# Altium schematic sheet MotherBoard_PowerSupply.SchDoc
size A4; DocumentNumber: 6; SheetNumber: 6; SheetTotal: 9
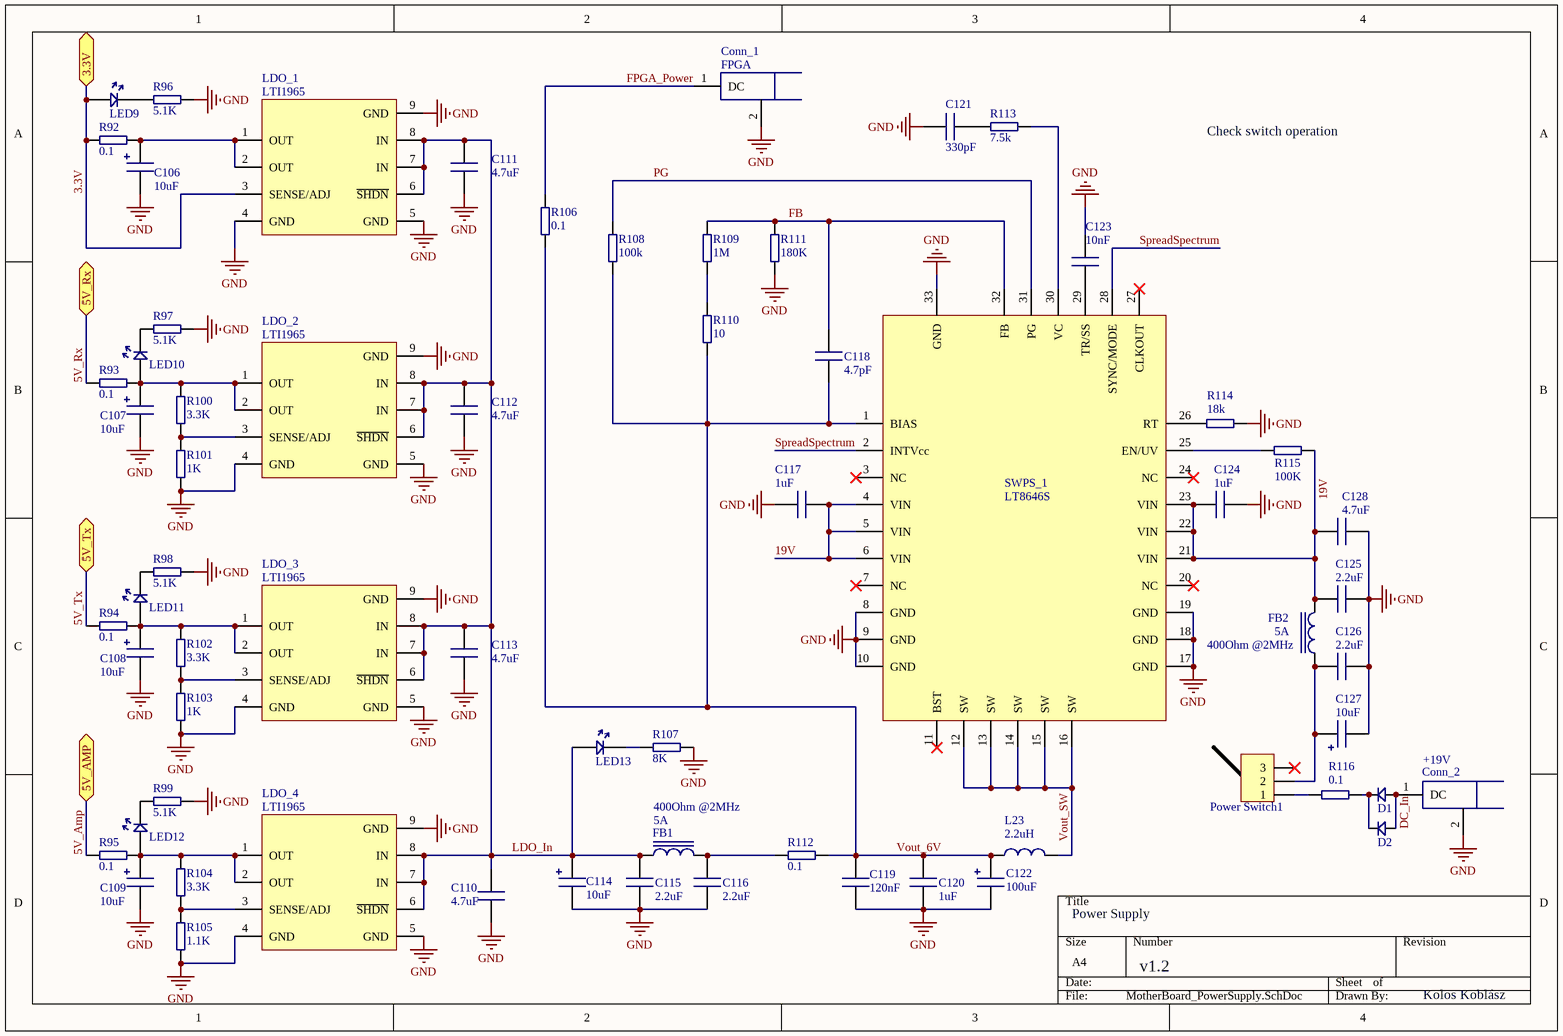
[diagram p0: MotherBoard_PowerSupply.SchDoc]

## Parts
C106  value 10uF  [ELKO_CAP]  (hidden comment: Cap2)
C107  value 10uF  [ELKO_CAP]  (hidden comment: Cap2)
C108  value 10uF  [ELKO_CAP]  (hidden comment: Cap2)
C109  value 10uF  [ELKO_CAP]  (hidden comment: Cap2)
C110  value 4.7uF  [0805 SMD Passive]  (hidden comment: Cap1)
C111  value 4.7uF  [0805 SMD Passive]  (hidden comment: Cap1)
C112  value 4.7uF  [0805 SMD Passive]  (hidden comment: Cap1)
C113  value 4.7uF  [0805 SMD Passive]  (hidden comment: Cap1)
C114  value 10uF  [ELKO_CAP]  (hidden comment: Cap2)
C115  value 2.2uF  [0805 SMD Passive]  (hidden comment: Cap1)
C116  value 2.2uF  [0805 SMD Passive]  (hidden comment: Cap1)
C117  value 1uF  [0805 SMD Passive]  (hidden comment: Cap1)
C118  value 4.7pF  [0805 SMD Passive]  (hidden comment: Cap1)
C119  value 120nF  [0805 SMD Passive]  (hidden comment: Cap1)
C120  value 1uF  [0805 SMD Passive]  (hidden comment: Cap1)
C121  value 330pF  [0805 SMD Passive]  (hidden comment: Cap1)
C122  value 100uF  [ELKO_CAP]  (hidden comment: Cap2)
C123  value 10nF  [0805 SMD Passive]  (hidden comment: Cap1)
C124  value 1uF  [0805 SMD Passive]  (hidden comment: Cap1)
C125  value 2.2uF  [0805 SMD Passive]  (hidden comment: Cap1)
C126  value 2.2uF  [0805 SMD Passive]  (hidden comment: Cap1)
C127  value 10uF  [ELKO_CAP]  (hidden comment: Cap2)
C128  value 4.7uF  [0805 SMD Passive]  (hidden comment: Cap1)
Conn_1  FPGA  [DC_Connector]
Conn_2  +19V  [DC_Connector]
D1  Diode1  [SMB]  (value not drawn)
D2  Diode1  [SMB]  (value not drawn)
FB1  value 400Ohm @2MHz  MaxCurent: 5A  [FerritBead]  (hidden comment: Ferrit Bead)
FB2  value 400Ohm @2MHz  MaxCurent: 5A  [FerritBead]  (hidden comment: Ferrit Bead)
L23  value 2.2uH  [SMD Inductor]  (hidden comment: Inductor)
LDO_1  LTI1965  [LT1965]
LDO_2  LTI1965  [LT1965]
LDO_3  LTI1965  [LT1965]
LDO_4  LTI1965  [LT1965]
LED9  +3.3V  [0805 SMD Passive]  (value not drawn)
LED10  +5V Rx  [0805 SMD Passive]  (value not drawn)
LED11  +5V Tx  [0805 SMD Passive]  (value not drawn)
LED12  +5V AMP  [0805 SMD Passive]  (value not drawn)
LED13  +6V  [0805 SMD Passive]  (value not drawn)
Power_Switch1  Switch  [Switch]  (value not drawn)
R92  value 0.1  [0805 SMD Passive]  (hidden comment: Resistor)
R93  value 0.1  [0805 SMD Passive]  (hidden comment: Resistor)
R94  value 0.1  [0805 SMD Passive]  (hidden comment: Resistor)
R95  value 0.1  [0805 SMD Passive]  (hidden comment: Resistor)
R96  value 5.1K  [0805 SMD Passive]  (hidden comment: Resistor)
R97  value 5.1K  [0805 SMD Passive]  (hidden comment: Resistor)
R98  value 5.1K  [0805 SMD Passive]  (hidden comment: Resistor)
R99  value 5.1K  [0805 SMD Passive]  (hidden comment: Resistor)
R100  value 3.3K  [0805 SMD Passive]  (hidden comment: Resistor)
R101  value 1K  [0805 SMD Passive]  (hidden comment: Resistor)
R102  value 3.3K  [0805 SMD Passive]  (hidden comment: Resistor)
R103  value 1K  [0805 SMD Passive]  (hidden comment: Resistor)
R104  value 3.3K  [0805 SMD Passive]  (hidden comment: Resistor)
R105  value 1.1K  [0805 SMD Passive]  (hidden comment: Resistor)
R106  value 0.1  [0805 SMD Passive]  (hidden comment: Resistor)
R107  value 8K  [0805 SMD Passive]  (hidden comment: Resistor)
R108  value 100k  [0805 SMD Passive]  (hidden comment: Resistor)
R109  value 1M  [0805 SMD Passive]  (hidden comment: Resistor)
R110  value 10  [0805 SMD Passive]  (hidden comment: Resistor)
R111  value 180K  [0805 SMD Passive]  (hidden comment: Resistor)
R112  value 0.1  [0805 SMD Passive]  (hidden comment: Resistor)
R113  value 7.5k  [0805 SMD Passive]  (hidden comment: Resistor)
R114  value 18k  [0805 SMD Passive]  (hidden comment: Resistor)
R115  value 100K  [0805 SMD Passive]  (hidden comment: Resistor)
R116  value 0.1  [0805 SMD Passive]  (hidden comment: Resistor)
SWPS_1  LT8646S  [LT8646S]

## Ports
3.3V, 5V_AMP, 5V_Rx, 5V_Tx

## Nets
GND: C106.2 C107.2 C108.2 C109.2 C110.1 C111.1 C112.1 C113.1 C114.2 C115.1 C116.1 C117.2 C119.2 C120.2 C121.1 C122.2 C123.1 C124.2 C125.1 C126.1 C127.2 C128.1 Conn_1.2(GND) Conn_2.2(GND) LDO_1.4(GND) LDO_1.5(GND) LDO_1.9(GND) LDO_2.4(GND) LDO_2.5(GND) LDO_2.9(GND) LDO_3.4(GND) LDO_3.5(GND) LDO_3.9(GND) LDO_4.4(GND) LDO_4.5(GND) LDO_4.9(GND) R96.2 R97.2 R98.2 R99.2 R101.1 R103.1 R105.1 R107.2 R111.2 R114.2 SWPS_1.8(GND) SWPS_1.9(GND) SWPS_1.10(GND) SWPS_1.17(GND) SWPS_1.18(GND) SWPS_1.19(GND) SWPS_1.33(GND)
3.3V: LDO_1.3(SENSE/ADJ) LED9.2(A) R92.1 ; port 3.3V
5V_Amp: R95.1 ; port 5V_AMP
5V_Rx: R93.1 ; port 5V_Rx
5V_Tx: R94.1 ; port 5V_Tx
19V: C117.1 C124.1 C125.2 C128.2 FB2.1 R115.1 SWPS_1.4(VIN) SWPS_1.5(VIN) SWPS_1.6(VIN) SWPS_1.21(VIN) SWPS_1.22(VIN) SWPS_1.23(VIN)
DC_In: Conn_2.1(DC) D1.2(A) D2.2(A)
FB: C118.1 R109.1 R111.1 SWPS_1.32(FB)
FPGA_Power: Conn_1.1(DC) R106.1
LDO_In: C110.2 C111.2 C112.2 C113.2 C114.1 C115.2 FB1.1 LDO_1.6(~{SHDN}) LDO_1.7(IN) LDO_1.8(IN) LDO_2.6(~{SHDN}) LDO_2.7(IN) LDO_2.8(IN) LDO_3.6(~{SHDN}) LDO_3.7(IN) LDO_3.8(IN) LDO_4.6(~{SHDN}) LDO_4.7(IN) LDO_4.8(IN) LED13.2(A)
PG: R108.1 SWPS_1.31(PG)
SpreadSpectrum: SWPS_1.2(INTVcc) SWPS_1.28(SYNC/MODE)
Vout_6V: C118.2 C119.1 C120.1 C122.1 L23.1 R106.2 R108.2 R110.2 R112.2 SWPS_1.1(BIAS)
Vout_SW: L23.2 SWPS_1.12(SW) SWPS_1.13(SW) SWPS_1.14(SW) SWPS_1.15(SW) SWPS_1.16(SW)
NetC106_1: C106.1 LDO_1.1(OUT) LDO_1.2(OUT) R92.2
NetC107_1: C107.1 LDO_2.1(OUT) LDO_2.2(OUT) LED10.2(A) R93.2 R100.2
NetC108_1: C108.1 LDO_3.1(OUT) LDO_3.2(OUT) LED11.2(A) R94.2 R102.2
NetC109_1: C109.1 LDO_4.1(OUT) LDO_4.2(OUT) LED12.2(A) R95.2 R104.2
NetC116_2: C116.2 FB1.2 R112.1
NetC121_2: C121.2 R113.1
NetC123_2: C123.2 SWPS_1.29(TR/SS)
NetC126_2: C126.2 C127.1 FB2.2 Power_Switch1.2
NetD1_1: D1.1(K) D2.1(K) R116.1
NetLDO_2_3: LDO_2.3(SENSE/ADJ) R100.1 R101.2
NetLDO_3_3: LDO_3.3(SENSE/ADJ) R102.1 R103.2
NetLDO_4_3: LDO_4.3(SENSE/ADJ) R104.1 R105.2
NetLED9_1: LED9.1(K) R96.1
NetLED10_1: LED10.1(K) R97.1
NetLED11_1: LED11.1(K) R98.1
NetLED12_1: LED12.1(K) R99.1
NetLED13_1: LED13.1(K) R107.1
NetPower_Switch1_1: Power_Switch1.1 R116.2
NetR109_2: R109.2 R110.1
NetR113_2: R113.2 SWPS_1.30(VC)
NetR114_1: R114.1 SWPS_1.26(RT)
NetR115_2: R115.2 SWPS_1.25(EN/UV)

Not connected (* = marked no-connect by the designer): Power_Switch1 3*; SWPS_1 3(NC)* 7(NC)* 11(BST)* 20(NC)* 24(NC)* 27(CLKOUT)*

## Notes on the sheet
- Check switch operation
- Power Supply
- v1.2
- Kolos Koblász

## Library data of the parts
C106-C109 C114 C122 C127 = Cap2: SMD Polarized Capacitor; Precision: 20%; MaxVolt: 16V; FootPrint: *
C110-C113 C115-C121 C123-C126 C128 = Cap1: SMD Capacitor; Precision: 5%; MaxVolt: 16V; FootPrint: *
Conn_1 Conn_2 = DC_Connector: Coaxial DC connector - female; Manufacturer: *; Size: *; Vmax: *; Imax: *
D1 = Diode1: Diode; Partnumber: DO-2144AA; MaxForwardCurrent: 100mA; MaxRevVoltage: 2A; Manufacturer: *; Type: *; OrderCode: 83-02-51
D2 = Diode1: Diode; Partnumber: DO-214AA; MaxForwardCurrent: 2A; MaxRevVoltage: 1000V; Manufacturer: *; Type: *; OrderCode: 83-02-51
FB1 FB2 = FerritBead: PartNumber: FB20022-4B-RC; Precision: 10%; FootPrint: THD; Digi Key Order Code: FB20022-4B-RC-ND
L23 = Ind1: SMD Inductor; Manufacturer: Coilcraft; PartNumber: XEL-4030-222; Precision: 20%; MaxCurent: 5A
LDO_1 = LTI1965: Low Dropout Linear Regulator; Manufacturer: Analog Devices; Order Code: LT1965EDD-3.3#PBF; Package Description: 8-Lead Plastic DFN; PartNumber: LTI1965; Version: Fix 3.3V
LDO_2-LDO_4 = LTI1965: Low Dropout Linear Regulator; Manufacturer: Analog Devices; Order Code: LT1965EDD#PBF; Package Description: 8-Lead Plastic DFN; PartNumber: LTI1965; Version: Adjustable
LED9-LED13 = LED_Green: Diode; Manufacturer: LITEON; Partnumber: LTST-C171KGKT; Type: Green; MaxForwardCurrent: 30mA; MaxRevVoltage: 5V; ForwardCurrent: 20mA; ForwardVoltage: 2V; OrderCode: 160-1426-1-ND; Footprint: 0805
Power_Switch1 = Switch: 3 state switch; PinNumber: 3; Pitch: 2.54mm; Type: THD 3 state; Digi Key Order Code: EG2355-ND
R92-R116 = Res1: SMD Resistor; Precision: 1%; MaxPower: 0.1W; FootPrint: SMD
SWPS_1 = LT8646S: Step-Down Silent Switcher Power Supply; Manufacturer: Analog Devices; Order Code: LT8646SEV#PBF; Package Description: LQFN; PartNumber: LT8646S